# Altium schematic sheet CPU.SchDoc
size A4
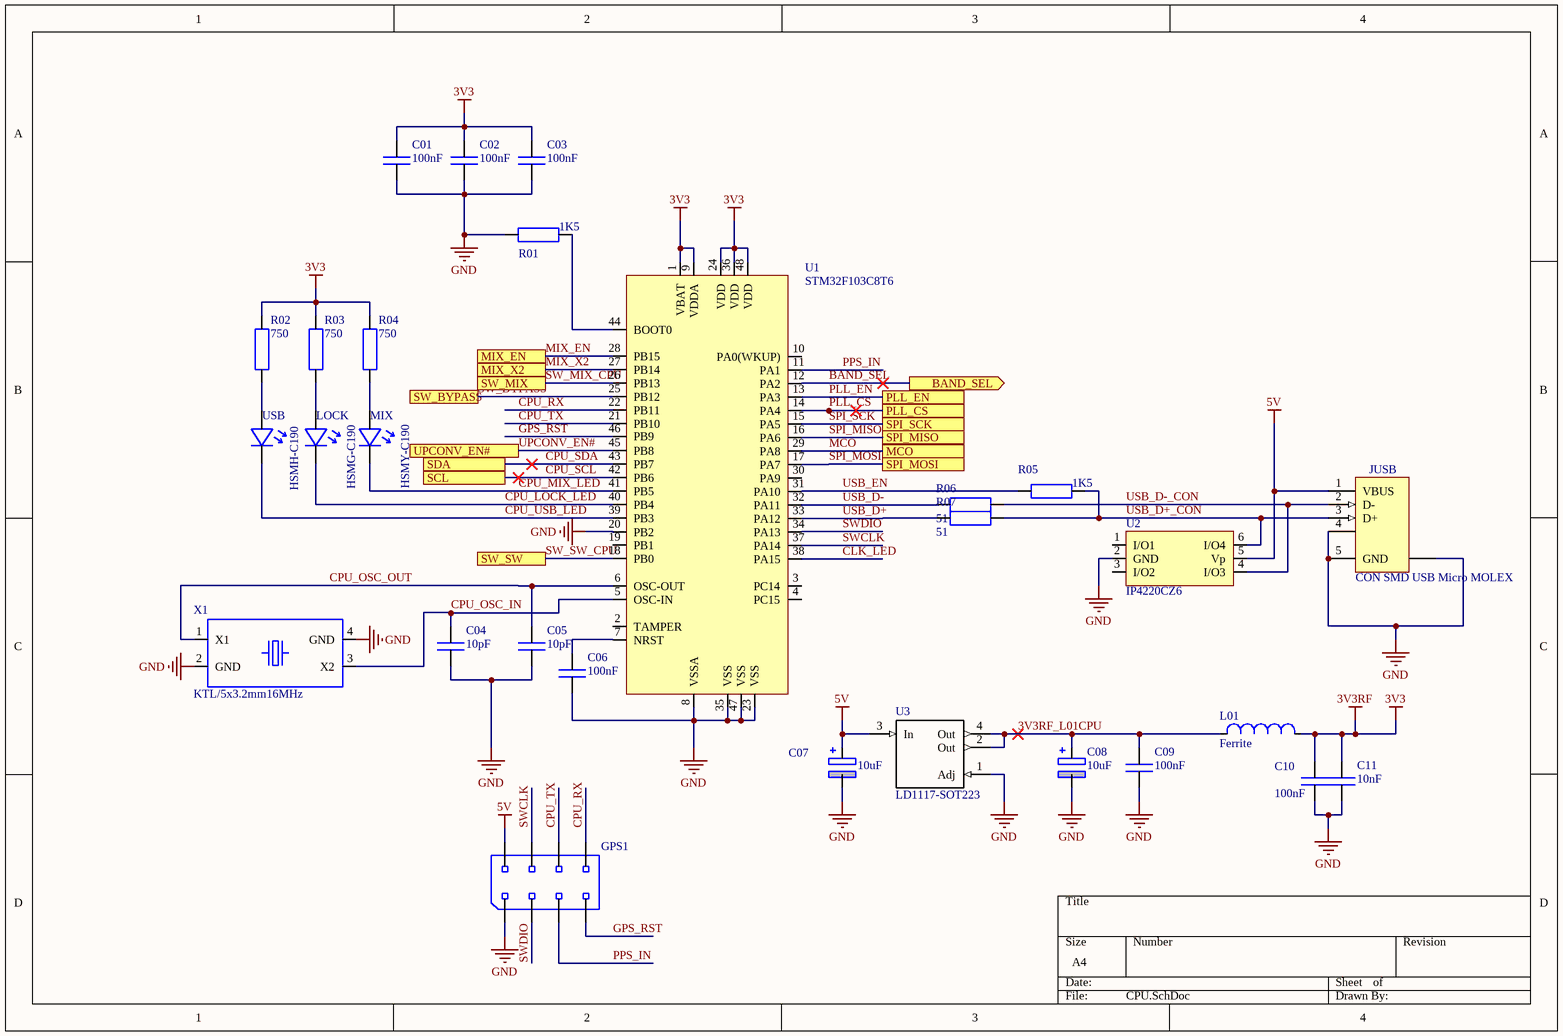
[diagram p0: CPU.SchDoc]

## Parts
C01  100nF  [smd C0603_0.80]
C02  100nF  [smd C0603_0.80]
C03  100nF  [smd C0603_0.80]
C04  10pF  [smd C0603_0.80]
C05  10pF  [smd C0603_0.80]
C06  100nF  [smd C0603_0.80]
C07  10uF  [smd C1206 polar]
C08  10uF  [smd C1206 polar]
C09  100nF  [smd C0603_0.80]
C10  100nF  [smd C0603_0.80]
C11  10nF  [smd C0603_0.80]
GPS1  (no value)  [hdr 2x4]
JUSB  CON SMD USB Micro MOLEX  [SMD USB MOLEX]
L01  Ferrite  [smd C0805]
LOCK  HSMG-C190  [led HSMH-C190 (Avago Technologies)]
MIX  HSMY-C190  [led HSMH-C190 (Avago Technologies)]
R01  1K5  [smd C0603_0.45]
R02  750  [smd C0603_0.45]
R03  750  [smd C0603_0.45]
R04  750  [smd C0603_0.45]
R05  1K5  [smd C0603_0.45]
R06  51  [smd C0603_0.45]
R07  51  [smd C0603_0.45]
U1  STM32F103C8T6  [TSQFP50P900X900X160-48N]
U2  IP4220CZ6  [smd SOT-457]
U3  LD1117-SOT223  [SOT223]
USB  HSMH-C190  [led HSMH-C190 (Avago Technologies)]
X1  KTL/5x3.2mm16MHz  [smd KTL 5x3.2]

## Ports
BAND_SEL (out), MCO, MIX_EN, MIX_X2, PLL_CS, PLL_EN, SCL, SDA, SPI_MISO, SPI_MOSI, SPI_SCK, SW_BYPASS, SW_MIX, SW_SW, UPCONV_EN#

## Nets
3V3: C01.2 C02.2 C03.2 C10.2 C11.2 L01.2 R02.2 R03.2 R04.2 U1.1(VBAT) U1.9(VDDA) U1.24(VDD) U1.36(VDD) U1.48(VDD)  [also labelled 3V3RF]
5V: C07.1 GPS1.2 JUSB.1(VBUS) U2.5(Vp) U3.3(In)
GND: C01.1 C02.1 C03.1 C04.1 C05.1 C06.1 C07.2 C08.2 C09.1 C10.1 C11.1 GPS1.1 JUSB.4(GND) JUSB.5(GND) JUSB.6(SHLD) R01.1 U1.8(VSSA) U1.20(PB2) U1.23(VSS) U1.35(VSS) U1.47(VSS) U2.2(GND) U3.1(Adj) X1.2(GND) X1.4(GND)
3V3RF_L01CPU: C08.1 C09.2 L01.1 U3.2(Out) U3.4(Out)
BAND_SEL: U1.12(PA2) ; port BAND_SEL
CLK_LED: U1.38(PA15)
CPU_LOCK_LED: LOCK.2 U1.40(PB4)
CPU_MIX_LED: MIX.2 U1.41(PB5)
CPU_OSC_IN: C04.2 U1.5(OSC-IN) X1.3(X2)
CPU_OSC_OUT: C05.2 U1.6(OSC-OUT) X1.1(X1)
CPU_RX: GPS1.8 U1.22(PB11)
CPU_SCL: U1.42(PB6) ; port SCL
CPU_SDA: U1.43(PB7) ; port SDA
CPU_TX: GPS1.6 U1.21(PB10)
CPU_USB_LED: U1.39(PB3) USB.2
GPS_RST: GPS1.7 U1.46(PB9)
MCO: U1.29(PA8) ; port MCO
MIX_EN: U1.28(PB15) ; port MIX_EN
MIX_X2: U1.27(PB14) ; port MIX_X2
PLL_CS: U1.14(PA4) ; port PLL_CS
PLL_EN: U1.13(PA3) ; port PLL_EN
PPS_IN: GPS1.5 U1.11(PA1)
SPI_MISO: U1.16(PA6) ; port SPI_MISO
SPI_MOSI: U1.17(PA7) ; port SPI_MOSI
SPI_SCK: U1.15(PA5) ; port SPI_SCK
SW_BYPASS: U1.25(PB12) ; port SW_BYPASS
SW_MIX_CPU: U1.26(PB13) ; port SW_MIX
SW_SW_CPU: U1.18(PB0) ; port SW_SW
SWCLK: GPS1.4 U1.37(PA14)
SWDIO: GPS1.3 U1.34(PA13)
UPCONV_EN#: U1.45(PB8) ; port UPCONV_EN#
USB_D+: R07.1 U1.33(PA12)
USB_D+_CON: JUSB.3(D+) R05.2 R07.2 U2.6(I/O4)
USB_D-: R06.1 U1.32(PA11)
USB_D-_CON: JUSB.2(D-) R06.2 U2.4(I/O3)
USB_EN: R05.1 U1.31(PA10)
NetC06_2: C06.2 U1.7(NRST)
NetLOCK_1: LOCK.1 R03.1
NetMIX_1: MIX.1 R04.1
NetR01_2: R01.2 U1.44(BOOT0)
NetR02_1: R02.1 USB.1

Not connected (* = marked no-connect by the designer): U1 2(TAMPER) 3(PC14) 4(PC15) 10(PA0(WKUP)) 19(PB1) 30(PA9); U2 1(I/O1) 3(I/O2)

## Library data of the parts
C01 C02 C03 C06 C09 C10 = CSMD603/100nF: smd capaciteit, verp.0603, 100nF; Part Number: CSMD603/100nF; Component Kind: Standard; Component Type: Standard; Designator: CSMD603/100nF; Pin Count: 2; Supplier 1: Farnell
C04 C05 = CSMD603/10pF: smd capaciteit, verp.0603, 10pF; Part Number: CSMD603/10pF; Component Kind: Standard; Component Type: Standard; Designator: CSMD603/10pF; Pin Count: 2; Supplier 1: Farnell
C07 C08 = CSMD1206/10uF/10V: smd capaciteit, tantalium, verp.1206, 10uF/10V; Part Number: CSMD1206/10uF/10V; Component Kind: Standard; Component Type: Standard; Designator: CSMD1206/10uF/10V; Pin Count: 2; Supplier 1: Farnell
C11 = CSMD603/10nF: smd capaciteit, verp.0603, 10nF; Part Number: CSMD603/10nF; Component Kind: Standard; Component Type: Standard; Pin Count: 2; Supplier 1: Farnell
GPS1 = CON HDR 2x4: pcb header recht 2x4  pitch 100mil; Part Number: CON HDR 2x4; Component Kind: Standard; Component Type: Standard; Designator: CON HDR 2x4; Pin Count: 8; Supplier 1: Farnell
JUSB = CON SMD USB Micro MOLEX: MOLEX - 47589-0001 - MICRO USB TYPE AB; Supplier 1: Farnell
L01 = Ferrite 0805: Ferrite bead, 0805 package; Supplier 1: Farnell
LOCK = HSMG-C190: led smd groen, Avago Techn., HSMG-C190; Supplier 1: Farnell
MIX = HSMY-C190: led smd geel, Avago Techn., HSMY-C190; Supplier 1: Farnell
R01 R05 = 1K5/603: weerstand SMD603, 1K5; Supplier 1: Farnell
R02 R03 R04 = 750R/603: weerstand SMD603, 750R; Supplier 1: Farnell
R06 R07 = 51R/603: weerstand SMD603, 51R; Supplier 1: Farnell
U1 = STM32F100xx
U2 = IP4220CZ6: Dual USB 2.0 integrated ESD protection; Supplier 1: Farnell
USB = HSMH-C190: led smd rood, Avago Techn., HSMH-C190; Supplier 1: Farnell
X1 = KTL/5x3.2mm 16MHz: TXC Xtal 16.000 MHz, 5x3.2mm; Part Number: KTL/5x3.2mm 16MHz; Component Kind: Standard; Component Type: Standard; Designator: KTL/5x3.2mm 16MHz; Pin Count: 4; Supplier 1: Farnell